# EAGLE design CCR2 (EAGLE 7.6.0)
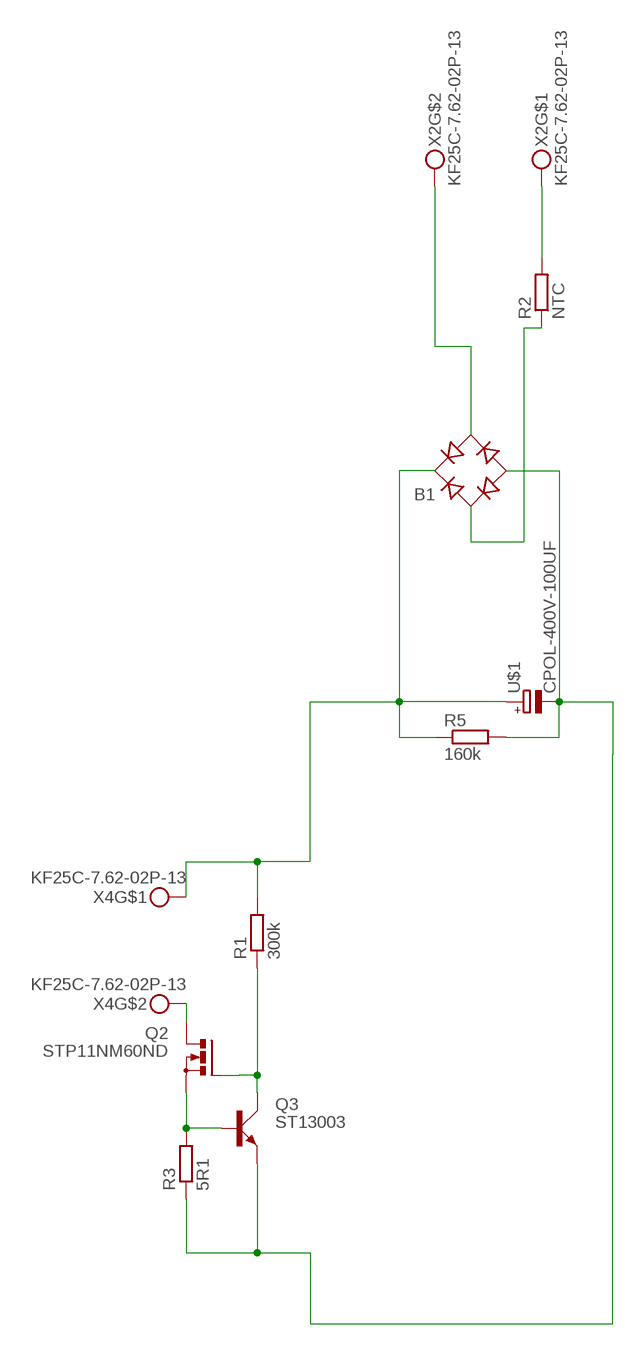
[diagram p0: schematic, sheet 1]

## Parts
B1  RB1A  [RB1A]
Q2  STP11NM60ND  BUZ11BV  [TO220BV]
Q3  ST13003  KSP42TA  [SOT-92WIDE]
R1  300k  R-EU_0411/12  [0411/12]
R2  NTC  R-EU_0309/10  [0309/10]
R3  5R1  R-EU_R0805  [R0805]
R5  160k  R-EU_0204/7  [0204/7]
U$1  CPOL-400V-100UF  [18*36.5_7.62]
X2  KF25C-7.62-02P-13  [KF25C-7.62-02P-13]
X4  KF25C-7.62-02P-13  [KF25C-7.62-02P-13]

## Nets
N$1: B1.+ R1.2 R5.1 U$1.P$2(+) X4.P$1
N$2: B1.AC1 R2.1
N$3: R2.2 X2.P$1
N$4: B1.AC2 X2.P$2
N$5: Q2.D X4.P$2
N$6: Q2.S Q3.B R3.2
N$7: Q2.G Q3.C R1.1
N$9: B1.- Q3.E R3.1 R5.2 U$1.P$1(-)

## Library data of the parts
B1 = rectifier:RB1A: RECTIFIER 1 A
Q2 = transistor-power:BUZ11: N-CHANNEL MOS FET
Q3 = Namenlos:KSP42TA
R1-R3 R5 = rcl:R-EU_: RESISTOR, European symbol
U$1 = Namenlos:CPOL-400V-100UF
X2 X4 = Namenlos:KF25C-7.62-02P-13

## Board
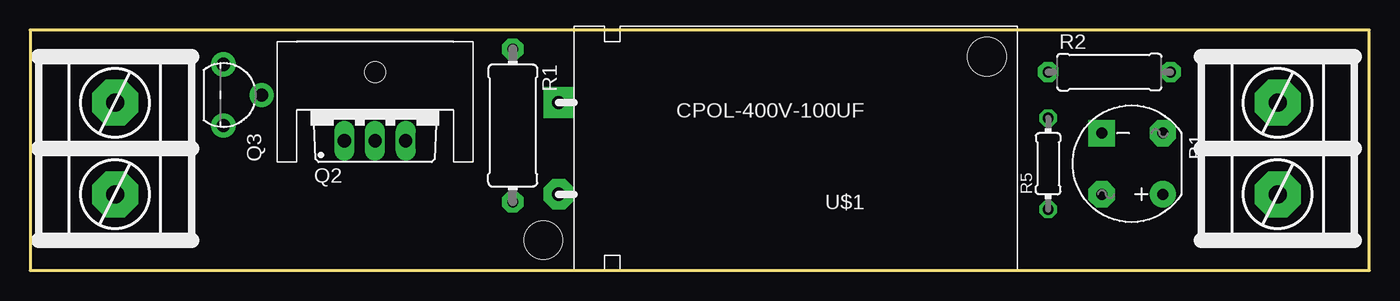
[diagram p1: board, top side]
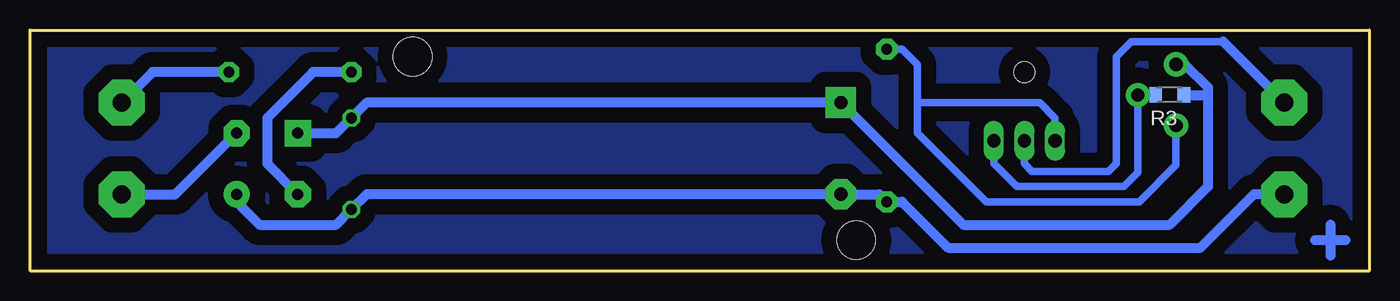
[diagram p2: board, bottom side, seen from below]

Size 111.19 x 20 mm. Coordinates in mm from the lower left corner, seen from the top.
Outline: 111.19,0 0,0 0,20 111.19,20 111.19,0
Copper layers (1*16): Top 0.035mm / dielectric 1.5mm / Bottom 0.035mm
Design rules "default": minimum track width 10mil, minimum drill 24mil, track to track 8mil, track to pad 8mil, pad to pad 8mil, via to via 8mil, smd to smd 8mil, copper to edge 40mil, drill to drill 8mil, minimum pad ring 10mil, minimum via ring 8mil, stop-mask expansion 4mil, vias tented up to drill 0mil, thermal gap 10mil
Holes 3.2 mm at 42.61,2.54 79.44,17.78

### Footprints (pad centres in the part's own frame; a part is rotated, then mirrored left to right if it is on the bottom)
RB1A = drill 0.9 pad 2.184: + -2.54,2.54 | drill 0.9 pad 2.184 square: - 2.54,-2.54 | drill 0.9 pad 2.184 octagon: AC1 2.54,2.54; AC2 -2.54,-2.54
TO220BV = drill 1.1 pad 1.422 long: D 0,-2.54; G -2.54,-2.54; S 2.54,-2.54
SOT-92WIDE = drill 1.1 pad 2: B 0,2.54; C 2.54,-0.635; E -2.54,-0.635
0411/12 = drill 0.9 pad 1.778 octagon: 1 -6.35,0; 2 6.35,0
0309/10 = drill 0.9 pad 1.676 octagon: 1 -5.08,0; 2 5.08,0
R0805 = smd 1.05 x 1.3: 1 -1.175,0; 2 1.175,0
0204/7 = drill 0.9 pad 1.422 octagon: 1 -3.81,0; 2 3.81,0
18*36.5_7.62 = drill 1.1 pad 2.54 square: P$1 0,-3.81 | drill 1.1 pad 2.54 octagon: P$2 0,3.81
SK95-3M3_HOLE = hole 1.7: 0,3.175
KF25C-7.62-02P-13 = drill 1.5 pad 3.81 octagon: P$1 -3.81,0; P$2 3.81,0

### Placement (x,y rotation side)
B1  91.51,8.89 180 top
Q2  28.64,13.34 0 top
Q3  16.68,14.6 270 top
R1  40.07,12.06 270 top
R2  89.6,16.51 0 top
R3  16.57,14.61 180 bottom
R5  84.52,8.89 90 top
U$1  43.88,10.16 180 top
U$2  [SK95-3M3_HOLE]  28.64,13.34 0 top
X2  103.57,10.16 270 top
X4  7.05,10.16 90 top

### Tracks (layer width: path | path; a pad name or v marks a point on that pad's centre or on a via)
N$1
  Bottom 0.813: B1.+ 94.05,5.71 92.14,3.81 85.79,3.81 R5.1 83.25,6.35 U$1.P$2 40.7,6.35 R1.2 38.8,5.71 34.99,1.91 14.04,1.91 9.59,6.35 X4.P$1
N$2
  Bottom 0.813: B1.AC1 91.51,8.89 91.51,12.7 87.7,16.51 R2.1
N$3
  Bottom 0.813: R2.2 101.03,16.51 X2.P$1
N$4
  Bottom 0.813: X2.P$2 99.12,6.35 B1.AC2
N$5
  Bottom 0.61: Q2.D 28.64,8.89 28,8.26 21.66,8.26 21.02,8.89 21.02,17.78 19.75,19.05 12.13,19.05
  Bottom 0.813: 12.13,19.05 X4.P$2
N$6
  Bottom 0.61: Q2.S 31.18,8.89 29.27,6.99 20.38,6.99 19.22,8.15 Q3.B
  Bottom 0.813: R3.2 Q3.B | Q3.B
N$7
  Bottom 0.61: 37.53,13.97 37.53,17.14 38.8,18.41 R1.1 | Q2.G 26.1,12.7 27.37,13.97 37.53,13.97 | 37.53,13.97 37.53,11.43 31.81,5.71 19.11,5.71 16.05,8.78 Q3.C
N$9
  Bottom 0.813: B1.- 85.79,11.43 R5.2 83.25,13.97 U$1.P$1 33.72,3.81 16.57,3.81 13.4,6.99 13.4,14.61 | Q3.E 15.3,17.14 13.4,15.24 13.4,14.61 | R3.1 13.4,14.61
N$10
  Bottom 0.813: 1.97,2.54 4.51,2.54
N$11
  Bottom 0.813: 3.24,3.81 3.24,1.27
N$133
  pour Bottom (isolate 1.27): -0.57,20.32 111.19,20.32 111.19,0 -0.57,0